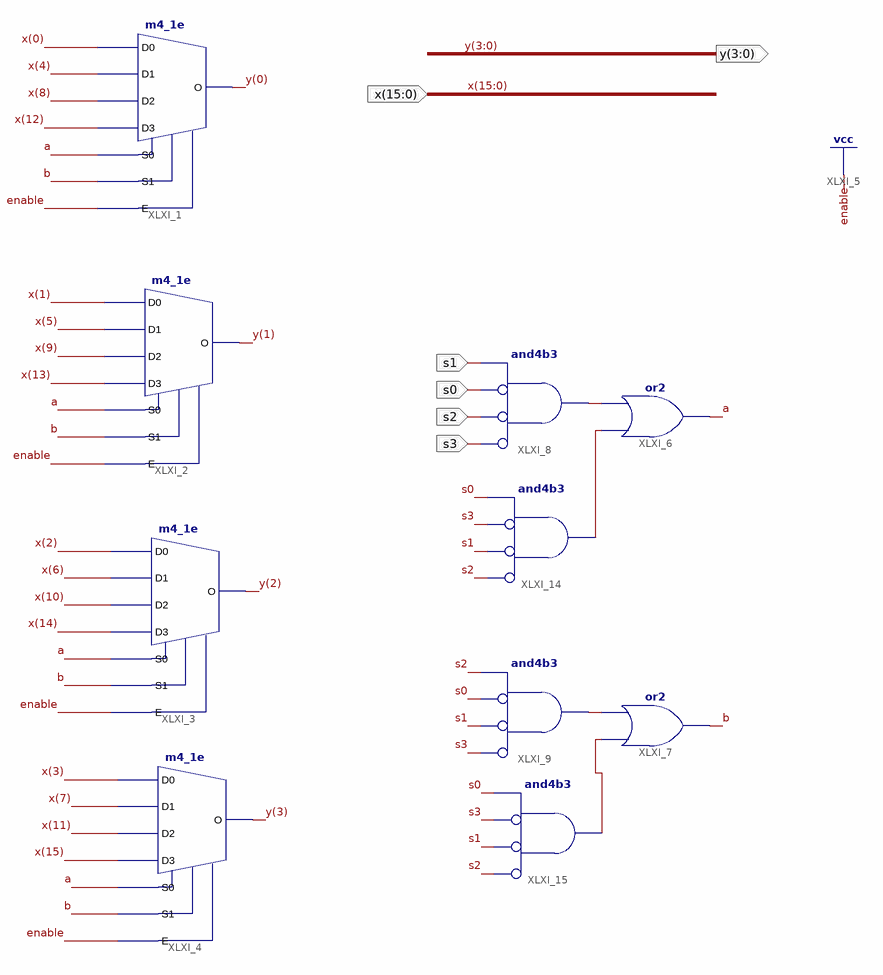
[diagram p0: schematic sheet 1]
// Xilinx ISE schematic Selector.sch (spartan3e) as structural Verilog: 10 symbols, 6 ports
module Selector (
  input  [15:0] x,
  input  s1,
  input  s0,
  input  s2,
  input  s3,
  output [3:0] y
);

  wire a, b, XLXN_36, XLXN_37, XLXN_39, XLXN_40;

  m4_1e XLXI_1 (.D0(x[0]), .D1(x[4]), .D2(x[8]), .D3(x[12]), .E(1'b1), .S0(a), .S1(b), .O(y[0]));
  m4_1e XLXI_2 (.D0(x[1]), .D1(x[5]), .D2(x[9]), .D3(x[13]), .E(1'b1), .S0(a), .S1(b), .O(y[1]));
  m4_1e XLXI_3 (.D0(x[2]), .D1(x[6]), .D2(x[10]), .D3(x[14]), .E(1'b1), .S0(a), .S1(b), .O(y[2]));
  m4_1e XLXI_4 (.D0(x[3]), .D1(x[7]), .D2(x[11]), .D3(x[15]), .E(1'b1), .S0(a), .S1(b), .O(y[3]));
  or XLXI_6 (a, XLXN_39, XLXN_36);
  and XLXI_8 (XLXN_36, ~s3, ~s2, ~s0, s1);  // and4b3
  or XLXI_7 (b, XLXN_40, XLXN_37);
  and XLXI_9 (XLXN_37, ~s3, ~s1, ~s0, s2);  // and4b3
  and XLXI_14 (XLXN_39, ~s2, ~s1, ~s3, s0);  // and4b3
  and XLXI_15 (XLXN_40, ~s2, ~s1, ~s3, s0);  // and4b3
endmodule
